# Altium schematic sheet DI.SchDoc
size 420 x 297 mm; Address1: Address1; Address2: Address2; Address3: Address3; Address4: Address4; SheetNumber: 1; Scale: 1:1; Разраб.: Иванов; Обозначение документа: АБВГ.123456.001 Э3; Пров.: Петров; Утв.: Сидоров; Наименование организации: ОАО "Концерн "МПО-Гидроприбор"; Перв. применение: АБВГ.123456.000; Наименование изделия 1: Плата; Наименование изделия 2: Схема электрическая; Наименование изделия 3: принципиальная; Нач. отд.: Нач. отд.; Фамилия нач. отд.: Сидоров
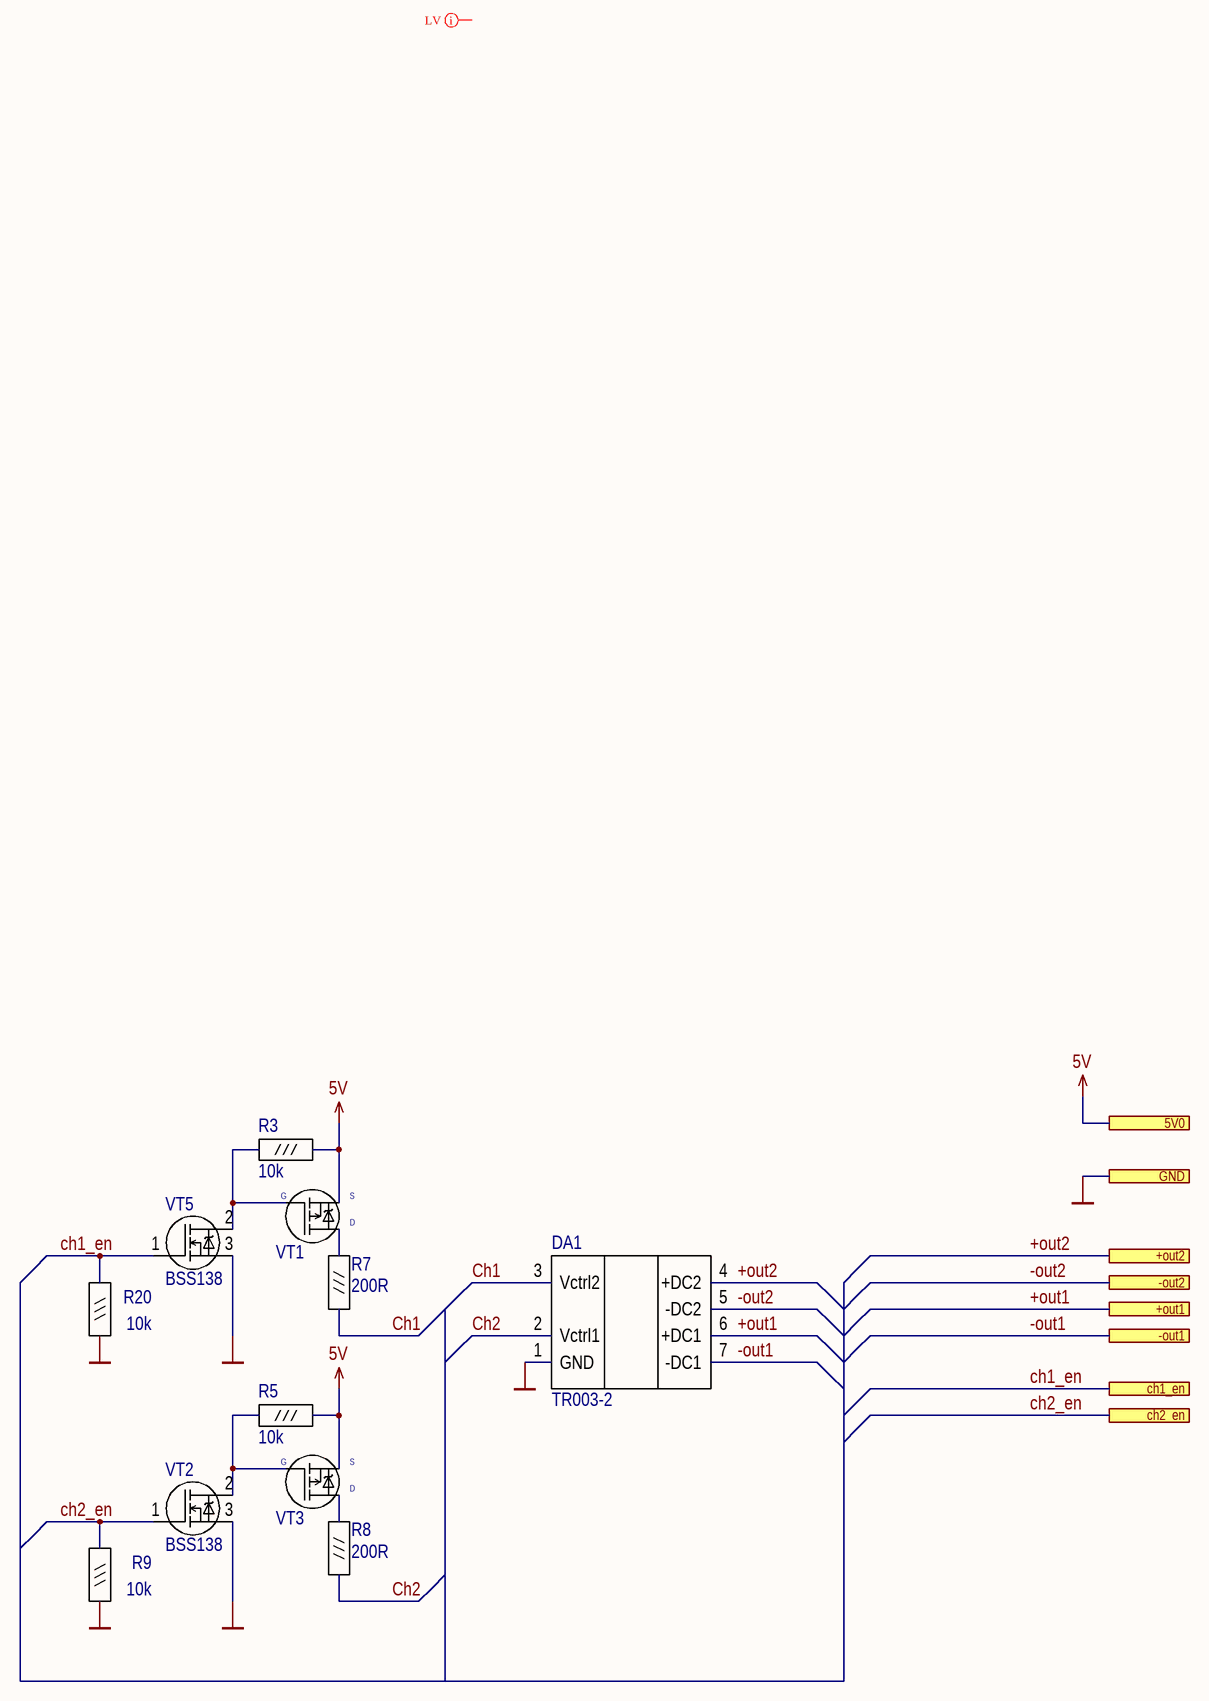
[diagram p0: DI.SchDoc]

## Parts
DA1  TR003-2  [TR003-2]
R3  10k  [R0603]
R5  10k  [R0603]
R7  200R  [R0603]
R8  200R  [R0603]
R9  10k  [R0603]
R20  10k  [R0603]
VT1  AO3401A  [sot23-3]  (value not drawn)
VT2  BSS138  [SOT23-3]
VT3  AO3401A  [sot23-3]  (value not drawn)
VT5  BSS138  [SOT23-3]

## Ports
5V0, +out1, +out2, -out1, -out2, ch1_en, ch2_en, GND

## Nets
5V: R3.1 R5.1 VT1.2(S) VT3.2(S) ; port 5V0
GND: DA1.1(GND) R9.1 R20.1 VT2.3(S) VT5.3(S) ; port GND
+out1: DA1.6(+DC1) ; port +out1
+out2: DA1.4(+DC2) ; port +out2
-out1: DA1.7(-DC1) ; port -out1
-out2: DA1.5(-DC2) ; port -out2
Ch1: DA1.3(Vctrl2) R7.1
ch1_en: R20.2 VT5.1(G) ; port ch1_en
Ch2: DA1.2(Vctrl1) R8.1
ch2_en: R9.2 VT2.1(G) ; port ch2_en
NetR3_2: R3.2 VT1.1(G) VT5.2(D)
NetR5_2: R5.2 VT2.2(D) VT3.1(G)
NetR7_2: R7.2 VT1.3(D)
NetR8_2: R8.2 VT3.3(D)

## Layout directives
net class LV: (no net found under the mark)

## Notes on the sheet
- Подп. и дата
- Инв. № дубл.
- Взам. инв. №
- Инв. № подл.
- Изм.
- Лист
- № докум.
- Подп.
- Дата
- Копировал
- Формат А3

## Library data of the parts
R3 R5 R9 R20 = 10k 5%: 10 kOhms ±5% 0.1W, 1/10W Chip Resistor 0603 (1608 Metric) Moisture Resistant Thick Film; MPN: RC0603JR-0710kL; Manufacturer: yageo; Name: 10k 5%; Voltage/Power: 0.063; Value: 10k; Tolerance: 5%; ComponentLink2URL: https://www.digikey.com/product-detail/en/yageo/RC0603JR-0710KL/311-10KGRTR-ND/726700; ComponentLink2Description: site; price elitan 1000pc: 0.17; price terra 1000pc: 0.15; LibraryPath: sch\res.schlib; FootprintPath: pcb\resSmd.pcblib
R7 R8 = 200R 5%: 200 Ohms ±5% 0.1W, 1/10W Chip Resistor 0603 (1608 Metric) Moisture Resistant Thick Film; MPN: RC0603JR-07200RL; Manufacturer: yageo; Name: 200R 5%; Voltage/Power: 0.063; Value: 200R; Tolerance: 5%; ComponentLink2URL: https://www.digikey.com/product-detail/en/yageo/RC0603JR-07200RL/311-200GRTR-ND/726737; ComponentLink2Description: site; price elitan 1000pc: 0.17; price terra 1000pc: 0.15; LibraryPath: sch\res.schlib; FootprintPath: pcb\resSmd.pcblib
VT1 VT3 = AO3401A: P-Channel 30V 4A (Ta) 1.4W (Ta) Surface Mount SOT-23-3L; Manufacturer: Infineon Technologies; Voltage/Power: 30V/4,0; MPN: AO3401A; Name: AO3401A; ComponentLink2URL: https://www.digikey.com/product-detail/en/alpha-omega-semiconductor-inc/AO3401A/785-1001-2-ND/1855773; ComponentLink2Description: site; price elitan 1000pc: 6.03; price terra 1000pc: 6.3; price chipdip 1000pc: 6; price dart 1000pc: 5.07
VT2 VT5 = BSS138: N-Channel 50V 200mA (Ta) 300mW (Ta) Surface Mount SOT-23-3; Manufacturer: Diodes Incorporated; Voltage/Power: 50V/0,2A; analogue: dart BSS138P (SOT-23) Uси=60В; Iи=0,36А; MPN: BSS138; Name: BSS138; ComponentLink2URL: https://www.digikey.com/product-detail/en/diodes-incorporated/BSS138-7-F/BSS138-FDITR-ND/717723; ComponentLink2Description: site; price elitan 1000pc: 1.83; price terra 1000pc: 2.3; price chipdip 1000pc: 3; price dart 1000pc: 2.6
DA1 = TR003-2: Name: TR003-2; MPN: TR003-2